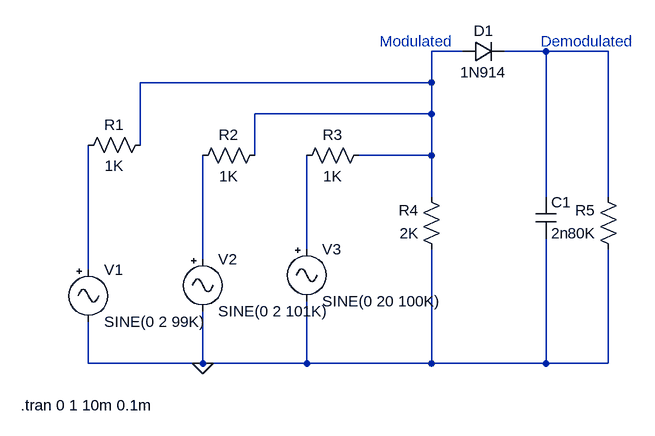
[diagram p0: schematic AM SCHEMATIC.asc]
AM SCHEMATIC.asc, the LTspice schematic file:
Version 4
SHEET 1 880 680
WIRE 448 -32 400 -32
WIRE 576 -32 512 -32
WIRE 672 -32 576 -32
WIRE 400 16 400 -32
WIRE 400 16 -48 16
WIRE 400 64 400 16
WIRE 400 64 128 64
WIRE -48 112 -48 16
WIRE 128 128 128 64
WIRE 400 128 400 64
WIRE 400 128 288 128
WIRE 400 192 400 128
WIRE 576 192 576 -32
WIRE 672 192 672 -32
WIRE 208 272 208 128
WIRE 48 288 48 128
WIRE -128 304 -128 112
WIRE -128 448 -128 384
WIRE 48 448 48 368
WIRE 48 448 -128 448
WIRE 208 448 208 352
WIRE 208 448 48 448
WIRE 400 448 400 272
WIRE 400 448 208 448
WIRE 576 448 576 256
WIRE 576 448 400 448
WIRE 672 448 672 272
WIRE 672 448 576 448
FLAG 48 448 0
SYMBOL res -32 96 R90
WINDOW 0 0 56 VBottom 2
WINDOW 3 32 56 VTop 2
SYMATTR InstName R1
SYMATTR Value 1K
SYMBOL res 144 112 R90
WINDOW 0 0 56 VBottom 2
WINDOW 3 32 56 VTop 2
SYMATTR InstName R2
SYMATTR Value 1K
SYMBOL res 304 112 R90
WINDOW 0 0 56 VBottom 2
WINDOW 3 32 56 VTop 2
SYMATTR InstName R3
SYMATTR Value 1K
SYMBOL res 416 288 R180
WINDOW 0 36 76 Left 2
WINDOW 3 36 40 Left 2
SYMATTR InstName R4
SYMATTR Value 2K
SYMBOL res 688 288 R180
WINDOW 0 36 76 Left 2
WINDOW 3 36 40 Left 2
SYMATTR InstName R5
SYMATTR Value 80K
SYMBOL cap 560 192 R0
SYMATTR InstName C1
SYMATTR Value 2n
SYMBOL diode 448 -16 R270
WINDOW 0 32 32 VTop 2
WINDOW 3 0 32 VBottom 2
SYMATTR InstName D1
SYMATTR Value 1N914
SYMBOL Misc\\signal -128 288 R0
SYMATTR InstName V1
SYMATTR Value SINE(0 2 99K)
SYMBOL Misc\\signal 48 272 R0
SYMATTR InstName V2
SYMATTR Value SINE(0 2 101K)
SYMBOL Misc\\signal 208 256 R0
SYMATTR InstName V3
SYMATTR Value SINE(0 20 100K)
TEXT 320 -48 Left 2 ;Modulated
TEXT 568 -48 Left 2 ;Demodulated
TEXT -232 512 Left 2 !.tran 0 1 10m 0.1m

The netlist it stands for:
* AM SCHEMATIC.asc
R1 N001 N005 1K
R2 N001 N004 1K
R3 N001 N003 1K
R4 0 N001 2K
R5 0 N002 80K
C1 N002 0 2n
D1 N001 N002 1N914
V1 N005 0 SINE(0 2 99K)
V2 N004 0 SINE(0 2 101K)
V3 N003 0 SINE(0 20 100K)
.model D D
.lib standard.dio
* Modulated
* Demodulated
.tran 0 1 10m 0.1m
.backanno
.end